# Altium schematic sheet Solenoid.SchDoc
size A
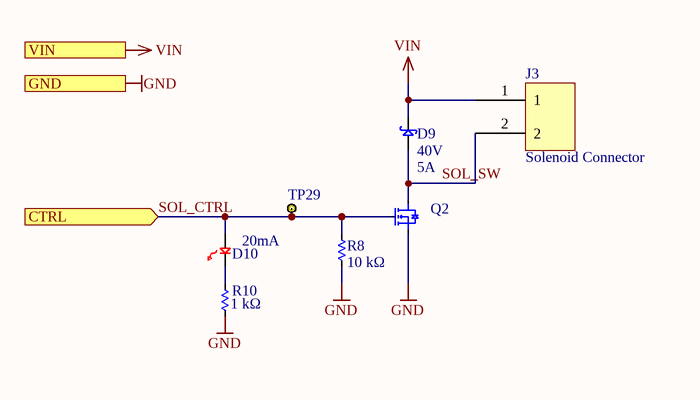
[diagram p0: Solenoid.SchDoc]

## Parts
D9  Voltage - DC Reverse (Vr) (Max): 40V  Current - Average Rectified (Io): 5A  [SMC]  (hidden comment: SCHOTTKY_B540C-13-F)
D10  Current - Test: 20mA  [0805_Diode]  (hidden comment: LED_LY974)
J3  Solenoid Connector  [Molex 172310-xx02]
Q2  NFET_CSD16323Q3  [8-VSON-THERMALS]  (value not drawn)
R8  Resistance: 10 kΩ  [R0603]  (hidden comment: 311-10.0KHRCT-ND)
R10  Resistance: 1 kΩ  [R0603]  (hidden comment: 311-1.00KHRCT-ND)
TP29  TEST_POINT_BLACK_KEYSTONE_5001  [TEST_POINT_KEYSTONE_5001]  (value not drawn)

## Ports
CTRL (in), GND (in), VIN (in)

## Nets
GND: Q2.3(S) R8.1 R10.1 ; port GND
VIN: D9.2 J3.1 ; port VIN
SOL_CTRL: D10.2 Q2.2(G) R8.2 TP29.1 ; port CTRL
SOL_SW: D9.1 J3.2 Q2.1(D)
NetD10_1: D10.1 R10.2

## Library data of the parts
D9 = CMP-033-0054-1: DIODE SCHOTTKY 40V 5A SMC; Manufacturer: Diodes Inc; Voltage - Forward (Vf) (Max) @ If: 550mV @ 5A; Speed: Fast Recovery =< 500ns, > 200mA (Io); Current - Reverse Leakage @ Vr: 500µA @ 40V; Capacitance @ Vr, F: 300pF @ 4V, 1MHz; Rule: UNIONINDEX=0|RULEKIND=PolygonConnect|NETSCOPE=AnyNet|LAYERKIND=SameLayer|NAME=Schematic Polygon Connect Style|CONNECTSTYLE=Direct|RELIEFCONDUCTORWIDTH=10mil|RELIEFENTRIES=4|POLYGONRELIEFANGLE=45 Angle|AIRGAPWIDTH=10mil|UNIT=Imperial; RoHS: RoHS Compliant; Stock 1: 22018; Pricing 1: 1=1.06, 10=0.912, 100=0.72, 250=0.624, 500=0.528, 1000=0.42 (USD); Diode Type: Schottky; Reverse Recovery Time (trr): -; Mounting Type: Surface Mount; Package / Case: DO-214AB, SMC; Supplier Device Package: SMC; Packaging: Cut Tape (CT); Datasheet: http://www.diodes.com/datasheets/ds13012.pdf; Manufacturer Part Number: B540C-13-F; Design Item ID: SCHOTTKY_B540C-13-F; Source: diode.SchLib
D10 = CMP-033-0001-1: LED 0805 RED 20MA; Manufacturer: OSRAM Opto Semiconductors Inc; Manufacturer Part Number: LH R974-LP-1; Viewing Angle: 160°; Lens Transparency: Diffused; Millicandela Rating: 41mcd; Lens Style/Size: Rectangle with Flat Top, 1.30mm x 1.25mm; Wavelength - Peak: 660nm; Wavelength - Dominant: 645nm; Voltage - Forward (Vf) (Typ): 1.8V; Lens Color: White; Stock 1: 66379; Pricing 1: 1=0.08, 10=0.07, 100=0.0559, 250=0.04892, 500=0.04472 (USD); Packaging: Cut Tape (CT); ComponentLink1URL: http://www.osram-os.com/Graphics/XPic8/00078869_0.pdf; ComponentLink1Description: http://www.osram-os.com/Graphics/XPic8/00078869_0.pdf; Design Item ID: LED_LY974; Source: diode.SchLib; Mounting Type: Surface Mount; Size / Dimension: 2.00mm L x 1.25mm W; Package / Case: 0805 (2012 Metric); RoHS: RoHS Compliant; Color: Red; Supplier Device Package: *; Height (Max): 0.80mm
J3 = CMP-025-0004-1: ULTRAFIT CONN HEADER R/A 2POS 3.5MM; Rule: UNIONINDEX=0|RULEKIND=PolygonConnect|NETSCOPE=AnyNet|LAYERKIND=SameLayer|NAME=Schematic Polygon Connect Style|CONNECTSTYLE=Direct|RELIEFCONDUCTORWIDTH=10mil|RELIEFENTRIES=4|POLYGONRELIEFANGLE=45 Angle|AIRGAPWIDTH=10mil|UNIT=Imperial; Source: connector.SchLib; Design Item ID: MOLEX_1x2_1723101102
Q2 = CMP-078-0020-11: MOSFET N-CH 25V 3.3X3.3 8-SON; Manufacturer: Texas Instruments; Vgs(th) (Max) @ Id: 1.4V @ 250µA; Gate Charge (Qg) @ Vgs: 8.4nC @ 4.5V; FET Type: MOSFET N-Channel, Metal Oxide; Current - Continuous Drain (Id) @ 25°C: 21A (Ta), 60A (Tc); FET Feature: Logic Level Gate; Input Capacitance (Ciss) @ Vds: 1300pF @ 12.5V; Rds On (Max) @ Id, Vgs: 4.5 mOhm @ 24A, 8V; Power - Max: 3W; Supplier Device Package: 8-VSON (3.3x3.3); Mounting Type: Surface Mount; Packaging: Cut Tape (CT); RoHS: RoHS Compliant By Exemption; Pricing 1: 1=1.19, 10=1.061, 100=0.8271, 500=0.68404, 1000=0.43625 (USD); Manufacturer Part Number: CSD16323Q3; Stock 1: 23688; Drain to Source Voltage (Vdss): 25V; Operating Temperature: -55°C ~ 150°C (TJ); ComponentLink1URL: http://www.ti.com/lit/ds/symlink/csd16323q3.pdf; Design Item ID: NFET_CSD16323Q3; Package / Case: 8-PowerTDFN; Source: transistor_fet.SchLib; ComponentLink1Description: http://www.ti.com/lit/ds/symlink/csd16323q3.pdf
R8 = CMP-126-0273-2: RES SMD 10K OHM 1% 1/10W 0603; Manufacturer Part Number: RC0603FR-0710KL; Manufacturer: Yageo; Resistance (Sortable): 10000; Power (Watts): 0.1W, 1/10W; Temperature Coefficient: ±100ppm/°C; Datasheets: http://www.yageo.com/documents/recent/PYu-RC_Group_51_RoHS_L_9.pdf; Image: //media.digikey.com/Renders/Yageo%20Renders/0603-(1608-Metric).jpg; Tolerance: ±1%; Operating Temperature: -55°C ~ 155°C
R10 = CMP-126-0172-2: RES SMD 1K OHM 1% 1/10W 0603; Manufacturer: Yageo; Manufacturer Part Number: RC0603FR-071KL; Power (Watts): 0.1W, 1/10W; Resistance (Sortable): 1000; Temperature Coefficient: ±100ppm/°C; Image: //media.digikey.com/Renders/Yageo%20Renders/0603-(1608-Metric).jpg; Operating Temperature: -55°C ~ 155°C; Tolerance: ±1%; Datasheets: http://www.yageo.com/documents/recent/PYu-RC_Group_51_RoHS_L_9.pdf
TP29 = CMP-055-0004-2: BLACK T/H TEST POINT; Manufacturer Part Number: 5001; Manufacturer: Keystone Electronics; Material - Body: Phosphor Bronze; Material - Insulation: Nylon 46, UL 94V-0; Plating: Silver; ComponentLink1Description: http://www.keyelco.com/product-pdf.cfm?p=1310; Source: mechanical.SchLib; Part Status: Active; Stock 1: 718799; RoHS: RoHS Compliant; Packaging: Bulk; Mounting Type: 0.040" (1.02mm) Hole Diameter; ComponentLink1URL: http://www.keyelco.com/product-pdf.cfm?p=1310; Pricing 1: 1=0.37, 10=0.316, 50=0.2298, 100=0.2209, 250=0.19832, 500=0.18932, 1000=0.1616, 2500=0.14424, 5000=0.13523 (USD); Size / Dimension: 0.100" Dia x 0.180" L (2.54mm x 4.57mm); Color: Black; Design Item ID: TEST_POINT_BLACK_KEYSTONE_5001